# Altium project remote.PrjPCB (part 2 of 2)

## Sheet receiver_car_2S_A.SchDoc
size A3
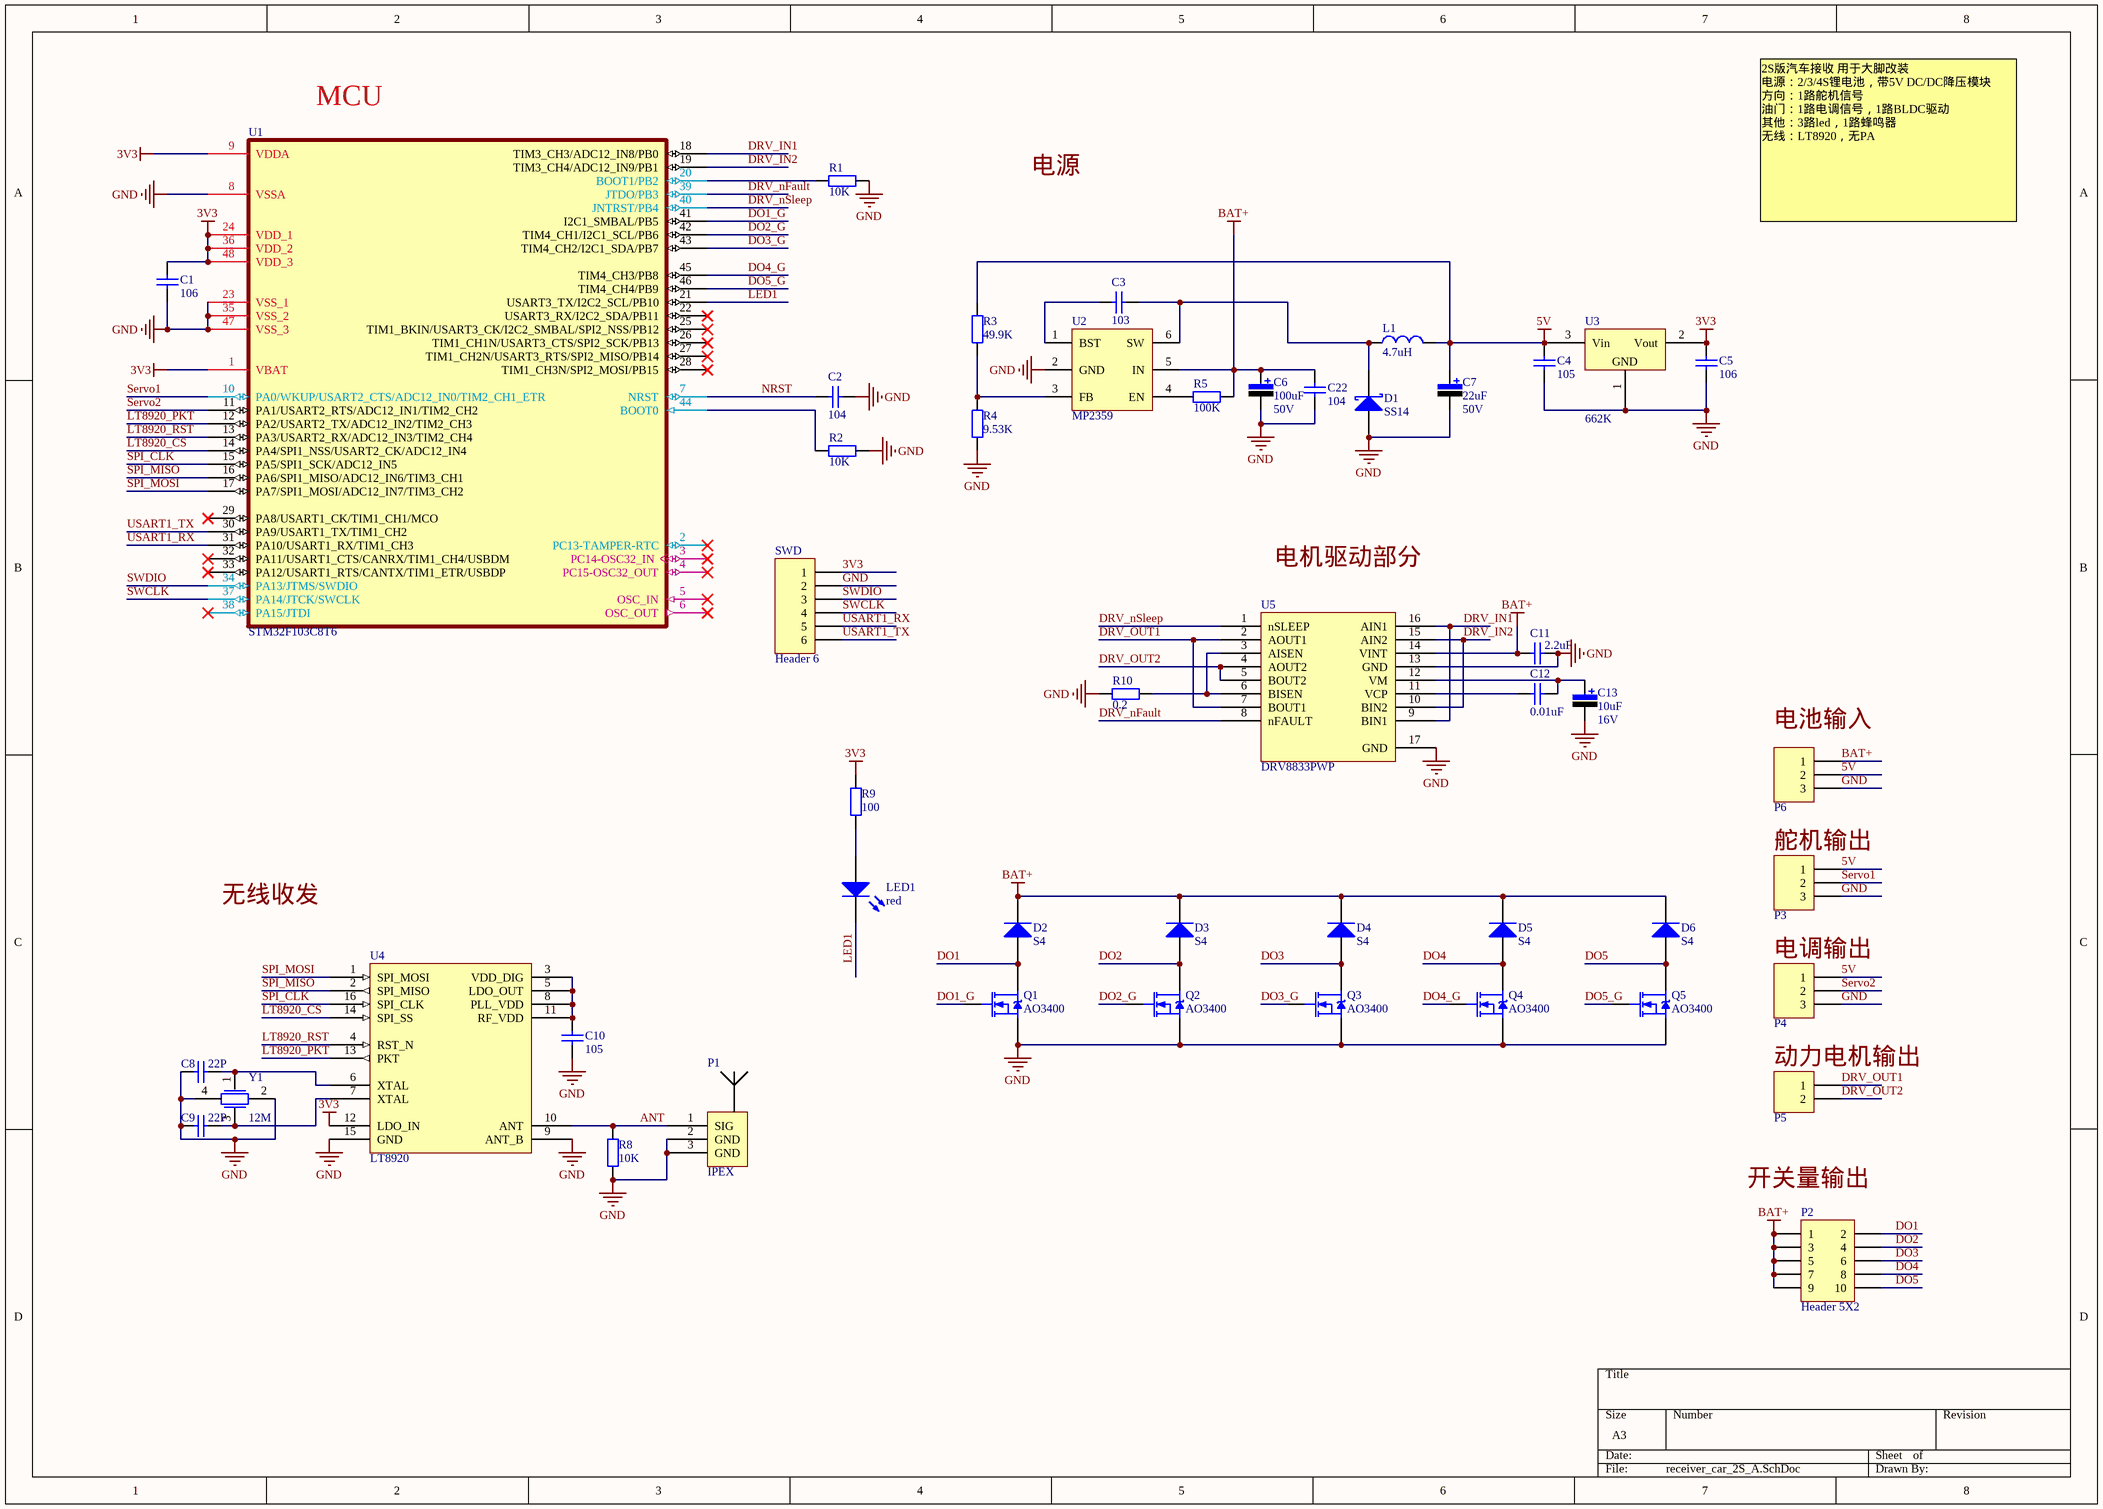
[diagram p7: receiver_car_2S_A.SchDoc]

### Parts
(Parts that share a designator on the sheet are numbered #1, #2 ... from top to bottom, then left to right.)
C1#7  106  [0805-2]
C2#9  value 104  [0805-2]  (hidden comment: Cap)
C3#5  103  [0805-2]
C4#6  value 105  [0805-2]  (hidden comment: Cap)
C5#6  value 106  [0805-2]  (hidden comment: Cap)
C6#5  value 100uF  Vol: 50V  [C-RB-S6]  (hidden comment: Cap Pol)
C7#4  value 22uF  Vol: 50V  [C-RB-S6]  (hidden comment: Cap Pol)
C8#4  value 22P  [0805-2]  (hidden comment: Cap)
C9#3  value 22P  [0805-2]  (hidden comment: Cap)
C10  value 105  [0805-2]  (hidden comment: Cap)
C11#2  value 2.2uF  [0805-2]  (hidden comment: Cap)
C12  value 0.01uF  [0805-2]  (hidden comment: Cap)
C13  value 10uF  Vol: 16V  [CAP-3216]  (hidden comment: Cap Pol)
C22  104  [0805-2]
D1#4  Type: SS14  [DIODE-SMA]  (hidden comment: D-Schottky)
D2#4  Type: S4  [SOD523]  (hidden comment: Diode)
D3#4  Type: S4  [SOD523]  (hidden comment: Diode)
D4#4  Type: S4  [SOD523]  (hidden comment: Diode)
D5#3  Type: S4  [SOD523]  (hidden comment: Diode)
D6#3  Type: S4  [SOD523]  (hidden comment: Diode)
L1#2  value 4.7uH  [l-SMD-4]  (hidden comment: Inductor)
LED1#2  red  [0603-1]
P1#4  IPEX  [U.FL-R-SMT]
P2#4  Header 5X2  [HDR5X2_A1]
P3#4  Header 3  [HDR3X1_A]  (value not drawn)
P4#3  Header 3  [HDR3X1_A]  (value not drawn)
P5#4  Header 2  [HDR2X1_A]  (value not drawn)
P6#3  Header 3  [HDR3X1_A]  (value not drawn)
Q1#2  AO3400  [SOT-23-3L]
Q2#2  AO3400  [SOT-23-3L]
Q3#2  AO3400  [SOT-23-3L]
Q4#2  AO3400  [SOT-23-3L]
Q5#2  AO3400  [SOT-23-3L]
R1#3  value 10K  [0805-2]  (hidden comment: Res1)
R2#4  value 10K  [0805-2]  (hidden comment: Res1)
R3#4  value 49.9K  [0805-2]  (hidden comment: Res1)
R4#3  value 9.53K  [0805-2]  (hidden comment: Res1)
R5#3  value 100K  [0805-2]  (hidden comment: Res1)
R8  value 10K  [0805-2]  (hidden comment: Res1)
R9  value 100  [0805-2]  (hidden comment: Res1)
R10  value 0.2  [0805-2]  (hidden comment: Res1)
SWD#4  Header 6  [HDR6*1*1.27]
U1#5  STM32F103C8T6  [STM-LQFP48_N]
U2#9  MP2359  [TSOT23-6]
U3#4  662K  [SOT-23]
U4#4  LT8920  [SSOP-16 LT8920]
U5  DRV8833PWP  [HTSSOP-16 DRV8833]
Y1#7  12M  [XTAL_3225]

### Nets
3V3: C1#7.2 C5#6.1 R9.2 SWD#4.1 U1#5.1(VBAT) U1#5.9(VDDA) U1#5.24(VDD_1) U1#5.36(VDD_2) U1#5.48(VDD_3) U3#4.2(Vout) U4#4.12(LDO_IN)
5V: C4#6.1 C7#4.1 L1#2.2 P3#4.1 P4#3.1 P6#3.2 R3#4.1 U3#4.3(Vin)
BAT+: C6#5.1 C11#2.2 C22.2 D2#4.2(K) D3#4.2(K) D4#4.2(K) D5#3.2(K) D6#3.2(K) P2#4.1 P2#4.3 P2#4.5 P2#4.7 P2#4.9 P6#3.1 R5#3.1 U2#9.5(IN) U5.14(VINT)
GND: C1#7.1 C2#9.2 C4#6.2 C5#6.2 C6#5.2 C7#4.2 C8#4.1 C9#3.1 C10.1 C11#2.1 C13.2 C22.1 D1#4.1(A) P1#4.2(GND) P1#4.3(GND) P3#4.3 P4#3.3 P6#3.3 Q1#2.S Q2#2.S Q3#2.S Q4#2.S Q5#2.S R1#3.2 R2#4.1 R4#3.2 R8.1 R10.2 SWD#4.2 U1#5.8(VSSA) U1#5.23(VSS_1) U1#5.35(VSS_2) U1#5.47(VSS_3) U2#9.2(GND) U3#4.1(Vss) U4#4.9(ANT_B) U4#4.15(GND) U5.13(GND) U5.17(GND) Y1#7.2 Y1#7.4
ANT: P1#4.1(SIG) R8.2 U4#4.10(ANT)
DO1: D2#4.1(A) P2#4.2 Q1#2.D
DO1_G: Q1#2.G U1#5.41(I2C1_SMBAL/PB5)
DO2: D3#4.1(A) P2#4.4 Q2#2.D
DO2_G: Q2#2.G U1#5.42(TIM4_CH1/I2C1_SCL/PB6)
DO3: D4#4.1(A) P2#4.6 Q3#2.D
DO3_G: Q3#2.G U1#5.43(TIM4_CH2/I2C1_SDA/PB7)
DO4: D5#3.1(A) P2#4.8 Q4#2.D
DO4_G: Q4#2.G U1#5.45(TIM4_CH3/PB8)
DO5: D6#3.1(A) P2#4.10 Q5#2.D
DO5_G: Q5#2.G U1#5.46(TIM4_CH4/PB9)
DRV_IN1: U1#5.18(TIM3_CH3/ADC12_IN8/PB0) U5.9(BIN1) U5.16(AIN1)
DRV_IN2: U1#5.19(TIM3_CH4/ADC12_IN9/PB1) U5.10(BIN2) U5.15(AIN2)
DRV_nFault: U1#5.39(JTDO/PB3) U5.8(nFAULT)
DRV_nSleep: U1#5.40(JNTRST/PB4) U5.1(nSLEEP)
DRV_OUT1: P5#4.1 U5.2(AOUT1) U5.7(BOUT1)
DRV_OUT2: P5#4.2 U5.4(AOUT2) U5.5(BOUT2)
LED1: LED1#2.2(K) U1#5.21(USART3_TX/I2C2_SCL/PB10)
LT8920_CS: U1#5.14(PA4/SPI1_NSS/USART2_CK/ADC12_IN4) U4#4.14(SPI_SS)
LT8920_PKT: U1#5.12(PA2/USART2_TX/ADC12_IN2/TIM2_CH3) U4#4.13(PKT)
LT8920_RST: U1#5.13(PA3/USART2_RX/ADC12_IN3/TIM2_CH4) U4#4.4(RST_N)
NRST: C2#9.1 U1#5.7(NRST)
SERVO1: P3#4.2 U1#5.10(PA0/WKUP/USART2_CTS/ADC12_IN0/TIM2_CH1_ETR)
SERVO2: P4#3.2 U1#5.11(PA1/USART2_RTS/ADC12_IN1/TIM2_CH2)
SPI_CLK: U1#5.15(PA5/SPI1_SCK/ADC12_IN5) U4#4.16(SPI_CLK)
SPI_MISO: U1#5.16(PA6/SPI1_MISO/ADC12_IN6/TIM3_CH1) U4#4.2(SPI_MISO)
SPI_MOSI: U1#5.17(PA7/SPI1_MOSI/ADC12_IN7/TIM3_CH2) U4#4.1(SPI_MOSI)
SWCLK: SWD#4.4 U1#5.37(PA14/JTCK/SWCLK)
SWDIO: SWD#4.3 U1#5.34(PA13/JTMS/SWDIO)
USART1_RX: SWD#4.5 U1#5.31(PA10/USART1_RX/TIM1_CH3)
USART1_TX: SWD#4.6 U1#5.30(PA9/USART1_TX/TIM1_CH2)
NetC3#5_1: C3#5.1 U2#9.1(BST)
NetC3#5_2: C3#5.2 D1#4.2(K) L1#2.1 U2#9.6(SW)
NetC8#4_2: C8#4.2 U4#4.6(XTAL) Y1#7.1
NetC9#3_2: C9#3.2 U4#4.7(XTAL) Y1#7.3
NetC10_2: C10.2 U4#4.3(VDD_DIG) U4#4.5(LDO_OUT) U4#4.8(PLL_VDD) U4#4.11(RF_VDD)
NetC12_1: C12.1 C13.1 U5.12(VM)
NetC12_2: C12.2 U5.11(VCP)
NetLED1#2_1: LED1#2.1(A) R9.1
NetR1#3_1: R1#3.1 U1#5.20(BOOT1/PB2)
NetR2#4_2: R2#4.2 U1#5.44(BOOT0)
NetR3#4_2: R3#4.2 R4#3.1 U2#9.3(FB)
NetR5#3_2: R5#3.2 U2#9.4(EN)
NetR10_1: R10.1 U5.3(AISEN) U5.6(BISEN)

Not connected (* = marked no-connect by the designer): U1#5 2(PC13-TAMPER-RTC)* 3(PC14-OSC32_IN)* 4(PC15-OSC32_OUT)* 5(OSC_IN)* 6(OSC_OUT)* 22(USART3_RX/I2C2_SDA/PB11)* 25(TIM1_BKIN/USART3_CK/I2C2_SMBAL/SPI2_NSS/PB12)* 26(TIM1_CH1N/USART3_CTS/SPI2_SCK/PB13)* 27(TIM1_CH2N/USART3_RTS/SPI2_MISO/PB14)* 28(TIM1_CH3N/SPI2_MOSI/PB15)* 29(PA8/USART1_CK/TIM1_CH1/MCO)* 32(PA11/USART1_CTS/CANRX/TIM1_CH4/USBDM)* 33(PA12/USART1_RTS/CANTX/TIM1_ETR/USBDP)* 38(PA15/JTDI)*

### Notes on the sheet
- (near U1#5) MCU
- 电源
- 2S版汽车接收 用于大脚改装
  电源：2/3/4S锂电池，带5V DC/DC降压模块
  方向：1路舵机信号
  油门：1路电调信号，1路BLDC驱动
  其他：3路led，1路蜂鸣器
  无线：LT8920，无PA
- 电机驱动部分
- (near P6#3) 电池输入
- (near P3#4) 舵机输出
- 无线收发
- (near P4#3) 电调输出
- (near P5#4) 动力电机输出
- (near P2#4) 开关量输出
- (in symbol 662K) GND

### Library data of the parts
C1#7 C3#5 = Cap Semi: Capacitor (Semiconductor SIM Model); Published: 8-Jun-2000; LatestRevisionDate: 29-May-2009; LatestRevisionNote: IPC-7351 Footprint Added.; PackageReference: C1206; Publisher: Altium Limited; PackageDescription: Chip Capacitor
  C1#7: Value: 106
  C3#5: Value: 103
C2#9 C4#6 C5#6 C8#4 C9#3 C10 C11#2 C12 = Cap: 无极性电容; Published: 8-Jun-2000; LatestRevisionDate: 17-Jul-2002; LatestRevisionNote: Re-released for DXP Platform.; PackageReference: RAD-0.3; Publisher: Altium Limited
C6#5 C7#4 C13 = Cap Pol: 极性电解电容; Published: 8-Jun-2000; LatestRevisionDate: 17-Jul-2002; LatestRevisionNote: Re-released for DXP Platform.; PackageReference: RB7.6-15; Publisher: Altium Limited
C22 = Cap Semi: Capacitor (Semiconductor SIM Model); Value: 106; Published: 8-Jun-2000; LatestRevisionDate: 29-May-2009; LatestRevisionNote: IPC-7351 Footprint Added.; PackageReference: C1206; Publisher: Altium Limited; PackageDescription: Chip Capacitor
D1#4 = D-Schottky: 肖特基二极管; Published: 8-Jun-2000; LatestRevisionDate: 17-Jul-2002; LatestRevisionNote: Re-released for DXP Platform.; PackageReference: SMB; Publisher: Altium Limited; Code_JEDEC: DO-214-AA
D2#4 D3#4 D4#4 D5#3 D6#3 = Diode: 二极管; Published: 8-Jun-2000; LatestRevisionDate: 17-Jul-2002; LatestRevisionNote: Re-released for DXP Platform.; PackageDocument: Sep-1996; PackageReference: SMC; Publisher: Altium Limited; Code_JEDEC: DO-214-AB
L1#2 = Inductor: 电感; Code_IEC: 1005; Published: 8-Jun-2000; LatestRevisionDate: 17-Jul-2002; LatestRevisionNote: Re-released for DXP Platform.; PackageReference: 0402-A; Publisher: Altium Limited; Code_JEITA: 0402
LED1#2 = LED3: Typical BLUE SiC LED; Published: 8-Jun-2000; LatestRevisionDate: 17-Dec-2003; LatestRevisionNote: PCB Footprint replaced.; DatasheetVersion: 16-Apr-2002; PackageVersion: 16-Apr-2002; PackageReference: 3.5X2.8X1.9; Publisher: Altium Limited; PackageDescription: SM LED; 2 C-Bend Leads; Body 3.5 x 2.8 x 1.9 mm, inc leads (LxWxH typ)
P1#4 = IPEX: U.FL-R-SMT
P2#4 = Header 5X2: 接插件; LatestRevisionDate: 17-Jul-2002; LatestRevisionNote: Re-released for DXP Platform.; Publisher: Altium Limited
P3#4 P4#3 P6#3 = Header 3: 接插件; LatestRevisionDate: 17-Jul-2002; LatestRevisionNote: Re-released for DXP Platform.; Publisher: Altium Limited
P5#4 = Header 2: 接插件; LatestRevisionDate: 17-Jul-2002; LatestRevisionNote: Re-released for DXP Platform.; Publisher: Altium Limited
Q1#2 Q2#2 Q3#2 Q4#2 Q5#2 = MOSFET-N: N-Channel MOSFET; PackageDocument: 1995/1996; Published: 8-Jun-2000; LatestRevisionDate: 17-Jul-2002; LatestRevisionNote: Re-released for DXP Platform.; PackageReference: E3; Publisher: Altium Limited
R1#3 R2#4 R3#4 R4#3 R5#3 R8-R10 = Res1: 贴片电阻; Published: 8-Jun-2000; LatestRevisionDate: 17-Jul-2002; LatestRevisionNote: Re-released for DXP Platform.; PackageReference: AXIAL-0.4; Publisher: Altium Limited
SWD#4 = Header 6: 接插件; LatestRevisionDate: 17-Jul-2002; LatestRevisionNote: Re-released for DXP Platform.; Publisher: Altium Limited
U1#5 = STM32F103C8T6: STM32 ARM-based 32-bit MCU with 64 Kbytes Flash, 48-pin LQFP, Industrial Temperature; Published: *; DatasheetVersion: *; PackageVersion: *; PackageReference: *; Publisher: *; PackageDescription: *; ComponentLink1Description: *; ComponentLink1URL: *; ComponentLink2Description: *; ComponentLink2URL: *
U5 = DRV8833PWP: DRV8833_HTSSOP封装
Y1#7 = XTAL-4PIN: 贴片晶振

## Nets that join several sheets
3V3: controller (9 pins), controller-4layer (10 pins), controller_PA (12 pins), receiver_plane (11 pins), receiver_plane_2S (9 pins), receiver_car_2s (10 pins), receiver_car_1s (C6#4.1 U2#7.2 U2#8.12), receiver_car_2S_A (11 pins)
5V: controller (7 pins), controller-4layer (6 pins), controller_PA (C5#3.1 D?#1.1 R?#1.2 USB#3.1), receiver_plane_2S (10 pins), receiver_car_2S_A (8 pins)
BAT+: controller (D2#1.1 P2#1.1 U3#1.3), controller-4layer (D2#2.1 P2#2.1 U3#2.3), controller_PA (D?#2.1 P?#3.1 U*.3), receiver_plane (5 pins), receiver_plane_2S (15 pins), receiver_car_2s (5 pins), receiver_car_1s (C?#21.2 P1#3.1 U?#10.12), receiver_car_2S_A (17 pins)
GND: controller (28 pins), controller-4layer (24 pins), controller_PA (39 pins), receiver_plane (35 pins), receiver_plane_2S (33 pins), receiver_car_2s (30 pins), receiver_car_1s (19 pins), receiver_car_2S_A (41 pins)
VCC: controller (6 pins), controller-4layer (C6#2.1 P3#2.1 P4#1.2 U4#2.3), controller_PA (D?#1.2 D?#2.2 P?#2.1 S?.1)
ANT: controller (P5#1.1 R1#1.2 U2#1.10), controller-4layer (P1#1.1 U2#2.10), receiver_plane_2S (P4#2.1 U4#3.10), receiver_car_1s (P5#3.1 U2#8.10), receiver_car_2S_A (P1#4.1 R8.2 U4#4.10)
DRV_AIN1: receiver_plane (U?#2.16), receiver_car_2s (U?#6.16)
DRV_AIN2: receiver_plane (U?#2.15), receiver_car_2s (U?#6.15)
DRV_AOUT1: receiver_plane (P?#6.1 U?#2.2), receiver_car_2s (P?#10.1 U?#6.2)
DRV_AOUT2: receiver_plane (P?#6.2 U?#2.4), receiver_car_2s (P?#10.2 U?#6.4)
DRV_BIN1: receiver_plane (U?#2.9), receiver_car_2s (U?#6.9)
DRV_BIN2: receiver_plane (U?#2.10), receiver_car_2s (U?#6.10)
DRV_BOUT1: receiver_plane (P?#7.1 U?#2.7), receiver_car_2s (P?#11.1 U?#6.7)
DRV_BOUT2: receiver_plane (P?#7.2 U?#2.5), receiver_car_2s (P?#11.2 U?#6.5)
DRV_nFault: receiver_car_2s (U?#6.8), receiver_car_2S_A (U1#5.39 U5.8)
DRV_nSleep: receiver_car_2s (U?#6.1), receiver_car_2S_A (U1#5.40 U5.1)
LED1: controller (R6#1.1 U1#1.10), controller-4layer (R6#2.1 U1#2.10), controller_PA (R?#5.1 U1#3.10), receiver_plane_2S (LED1#1.2 U3#3.32), receiver_car_2S_A (LED1#2.2 U1#5.21)
LED2: controller (R7#1.1 U1#1.9), controller-4layer (R7#2.1 U1#2.9), controller_PA (R?#6.1 U1#3.9)
LED_CHG: controller (R4#1.1 U3#1.1), controller-4layer (R4#2.1 U3#2.1), controller_PA (R?#3.1 U*.1)
LED_STD: controller (R5#1.1 U3#1.5), controller-4layer (R5#2.1 U3#2.5), controller_PA (R?#4.1 U*.5)
LT8920_CS: controller (U1#1.17 U2#1.14), controller-4layer (U1#2.17 U2#2.14), controller_PA (U1#3.17 U2#3.14), receiver_plane (U2#4.14), receiver_plane_2S (U3#3.29 U4#3.14), receiver_car_2s (U2#6.14), receiver_car_1s (U2#8.14), receiver_car_2S_A (U1#5.14 U4#4.14)
LT8920_PKT: controller (U1#1.7 U2#1.13), controller-4layer (U1#2.7 U2#2.13), controller_PA (U1#3.7 U2#3.13), receiver_plane (U2#4.13), receiver_plane_2S (U3#3.30 U4#3.13), receiver_car_2s (U2#6.13), receiver_car_1s (U2#8.13), receiver_car_2S_A (U1#5.12 U4#4.13)
LT8920_RST: controller (U1#1.14 U2#1.4), controller-4layer (U1#2.14 U2#2.4), controller_PA (U1#3.14 U2#3.4), receiver_plane (U2#4.4), receiver_plane_2S (U3#3.25 U4#3.4), receiver_car_2s (U2#6.4), receiver_car_1s (U2#8.4), receiver_car_2S_A (U1#5.13 U4#4.4)
NRST: controller (C9#1.1 U1#1.4), controller-4layer (C9#2.1 U1#2.4), controller_PA (SWD#3.5 U1#3.4), receiver_car_2S_A (C2#9.1 U1#5.7)
PA_Rx: controller_PA (*#1.6 U1#3.8), receiver_plane (*#3.6), receiver_car_2s (*#5.6)
PA_Tx: controller_PA (*#1.5 U1#3.6), receiver_plane (*#3.5), receiver_car_2s (*#5.5)
PS2PAD_CS: controller (P3#1.5 U1#1.18), controller-4layer (P3#2.5 U1#2.18), controller_PA (P?#2.5 U1#3.18)
SERVO1: receiver_plane_2S (P9.2 U3#3.12), receiver_car_2S_A (P3#4.2 U1#5.10)
SERVO2: receiver_plane_2S (P10.2 U3#3.13), receiver_car_2S_A (P4#3.2 U1#5.11)
SPI_CLK: controller (P3#1.3 U1#1.11 U2#1.16), controller-4layer (P3#2.3 U1#2.11 U2#2.16), controller_PA (P?#2.3 U1#3.11 U2#3.16), receiver_plane (U2#4.16 U?#5.11), receiver_plane_2S (U3#3.26 U4#3.16), receiver_car_2s (U2#6.16 U?#9.11), receiver_car_1s (U2#8.16), receiver_car_2S_A (U1#5.15 U4#4.16)
SPI_MISO: controller (P3#1.6 U1#1.12 U2#1.2), controller-4layer (P3#2.6 U1#2.12 U2#2.2), controller_PA (P?#2.6 U1#3.12 U2#3.2), receiver_plane (U2#4.2 U?#5.12), receiver_plane_2S (U3#3.27 U4#3.2), receiver_car_2s (U2#6.2 U?#9.12), receiver_car_1s (U2#8.2), receiver_car_2S_A (U1#5.16 U4#4.2)
SPI_MOSI: controller (P3#1.7 U1#1.13 U2#1.1), controller-4layer (P3#2.7 U1#2.13 U2#2.1), controller_PA (P?#2.7 U1#3.13 U2#3.1), receiver_plane (U2#4.1 U?#5.13), receiver_plane_2S (U3#3.28 U4#3.1), receiver_car_2s (U2#6.1 U?#9.13), receiver_car_1s (U2#8.1), receiver_car_2S_A (U1#5.17 U4#4.1)
SWCLK: controller (SWD#1.4 U1#1.20), controller-4layer (SWD#2.6 U1#2.20), controller_PA (SWD#3.1 U1#3.20), receiver_plane (U?#5.24), receiver_plane_2S (P3#3.1 U3#3.24), receiver_car_2s (U?#9.24), receiver_car_2S_A (SWD#4.4 U1#5.37)
SWDIO: receiver_plane_2S (P3#3.2 U3#3.23), receiver_car_2S_A (SWD#4.3 U1#5.34)
SWIO: controller (SWD#1.3 U1#1.19), controller-4layer (SWD#2.5 U1#2.19), controller_PA (SWD#3.2 U1#3.19), receiver_plane (U?#5.23), receiver_car_2s (U?#9.23)
UART_Rx: receiver_plane (U?#5.9), receiver_plane_2S (P2#3.2 U3#3.20), receiver_car_2s (U?#9.9)
UART_Tx: receiver_plane (U?#5.8), receiver_plane_2S (P2#3.3 U3#3.19), receiver_car_2s (U?#9.8)
USART1_TX: controller-4layer (SWD#2.2 U1#2.8), receiver_car_2S_A (SWD#4.6 U1#5.30)
USB_V+: controller (5 pins), controller-4layer (C5#2.1 D1#2.1 USB#2.1)